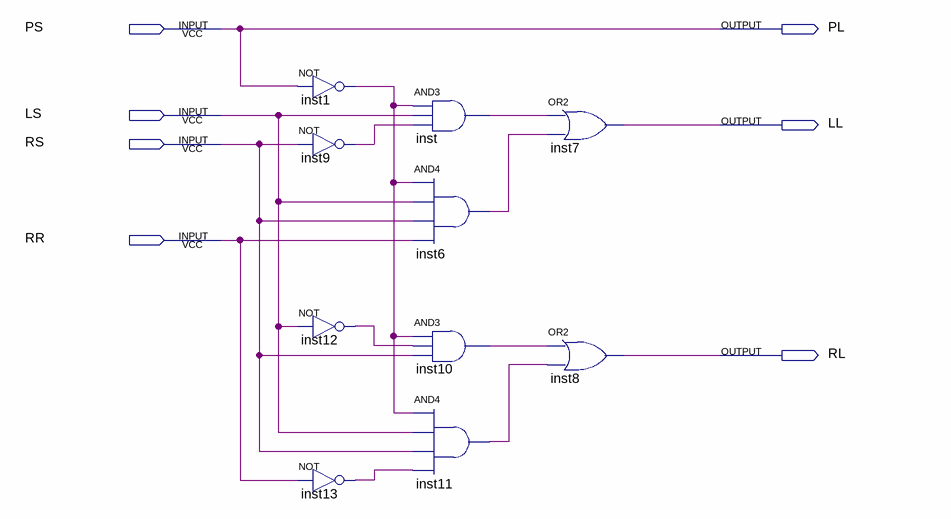
[diagram p0: schematic sheet]
// Quartus schematic Lab01_2.bdf as structural Verilog: 10 symbols, 7 pins
module Lab01_2 (
  input  PS,
  input  LS,
  input  RS,
  input  RR,
  output PL,
  output LL,
  output RL
);

  wire inst1_out, inst6_out, inst9_out, inst10_out, inst11_out, inst12_out, inst13_out, inst_out;

  not inst1 (inst1_out, PS);
  not inst9 (inst9_out, RS);
  not inst12 (inst12_out, LS);
  not inst13 (inst13_out, RR);
  and inst (inst_out, inst1_out, LS, inst9_out);
  and inst6 (inst6_out, inst1_out, LS, RS, RR);
  and inst10 (inst10_out, inst1_out, inst12_out, RS);
  and inst11 (inst11_out, inst1_out, LS, RS, inst13_out);
  or inst7 (LL, inst_out, inst6_out);
  or inst8 (RL, inst10_out, inst11_out);

  assign PL = PS;
endmodule
